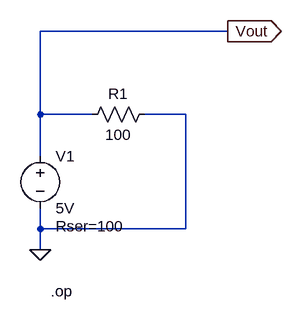
[diagram p0: schematic E2 Source Resistance.asc]
E2 Source Resistance.asc, the LTspice schematic file:
Version 4
SHEET 1 880 680
WIRE 320 -80 32 -80
WIRE 32 48 32 -80
WIRE 112 48 32 48
WIRE 256 48 192 48
WIRE 32 112 32 48
WIRE 32 224 32 192
WIRE 256 224 256 48
WIRE 256 224 32 224
WIRE 32 256 32 224
FLAG 32 256 0
FLAG 320 -80 Vout
IOPIN 320 -80 Out
SYMBOL voltage 32 96 R0
WINDOW 123 0 0 Left 0
WINDOW 39 24 124 Left 2
SYMATTR InstName V1
SYMATTR Value 5V
SYMATTR SpiceLine Rser=100
SYMBOL res 208 32 R90
WINDOW 0 0 56 VBottom 2
WINDOW 3 32 56 VTop 2
SYMATTR InstName R1
SYMATTR Value 100
TEXT 48 320 Left 2 !.op

The netlist it stands for:
* E2 Source Resistance.asc
V1 Vout 0 5V Rser=100
R1 0 Vout 100
.op
.backanno
.end